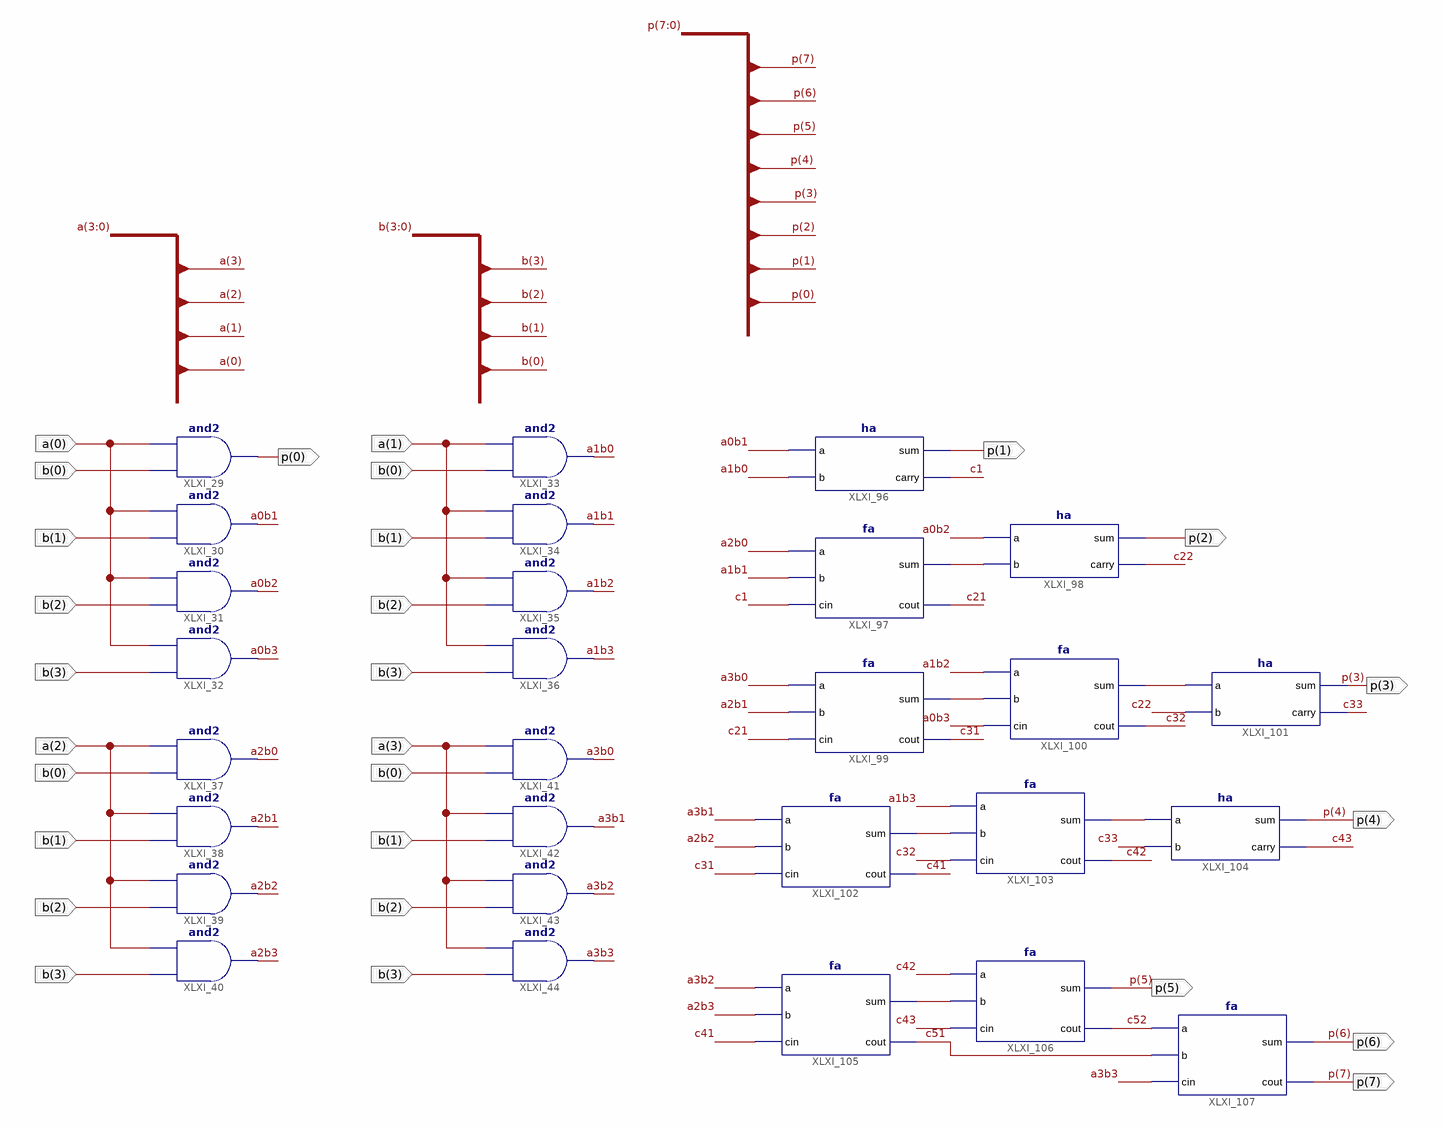
[diagram p0: schematic sheet 1]
// Xilinx ISE schematic mymul44.sch (xc9500) as structural Verilog: 28 symbols, 16 ports
module mymul44 (
  input  [3:0] a,
  input  [3:0] b,
  output [7:0] p
);

  wire a0b1, a0b2, a0b3, a1b0, a1b1, a1b2, a1b3, a2b0, a2b1, a2b2, a2b3, a3b0, a3b1, a3b2, a3b3, c1, c21,
       c22, c31, c32, c33, c41, c42, c43, c51, c52, XLXN_234, XLXN_239, XLXN_242, XLXN_251, XLXN_255,
       XLXN_263;

  and XLXI_29 (p[0], b[0], a[0]);
  and XLXI_30 (a0b1, b[1], a[0]);
  and XLXI_31 (a0b2, b[2], a[0]);
  and XLXI_32 (a0b3, b[3], a[0]);
  and XLXI_33 (a1b0, b[0], a[1]);
  and XLXI_34 (a1b1, b[1], a[1]);
  and XLXI_35 (a1b2, b[2], a[1]);
  and XLXI_36 (a1b3, b[3], a[1]);
  and XLXI_39 (a2b2, b[2], a[2]);
  and XLXI_38 (a2b1, b[1], a[2]);
  and XLXI_37 (a2b0, b[0], a[2]);
  and XLXI_40 (a2b3, b[3], a[2]);
  and XLXI_41 (a3b0, b[0], a[3]);
  and XLXI_42 (a3b1, b[1], a[3]);
  and XLXI_43 (a3b2, b[2], a[3]);
  and XLXI_44 (a3b3, b[3], a[3]);
  ha XLXI_96 (.a(a0b1), .b(a1b0), .sum(p[1]), .carry(c1));
  fa XLXI_97 (.cout(c21), .cin(c1), .a(a2b0), .b(a1b1), .sum(XLXN_234));
  ha XLXI_98 (.a(a0b2), .b(XLXN_234), .sum(p[2]), .carry(c22));
  fa XLXI_99 (.cout(c31), .cin(c21), .a(a3b0), .b(a2b1), .sum(XLXN_239));
  fa XLXI_100 (.cout(c32), .cin(a0b3), .a(a1b2), .b(XLXN_239), .sum(XLXN_242));
  ha XLXI_101 (.a(XLXN_242), .b(c22), .sum(p[3]), .carry(c33));
  fa XLXI_102 (.cout(c41), .cin(c31), .a(a3b1), .b(a2b2), .sum(XLXN_251));
  fa XLXI_103 (.cout(c42), .cin(c32), .a(a1b3), .b(XLXN_251), .sum(XLXN_255));
  ha XLXI_104 (.a(XLXN_255), .b(c33), .sum(p[4]), .carry(c43));
  fa XLXI_105 (.cout(c51), .cin(c41), .a(a3b2), .b(a2b3), .sum(XLXN_263));
  fa XLXI_106 (.cout(c52), .cin(c43), .a(c42), .b(XLXN_263), .sum(p[5]));
  fa XLXI_107 (.cout(p[7]), .cin(a3b3), .a(c52), .b(c51), .sum(p[6]));
endmodule
